# EAGLE schematic d11_micro_usb_std_v2 (EAGLE 7.3.0)
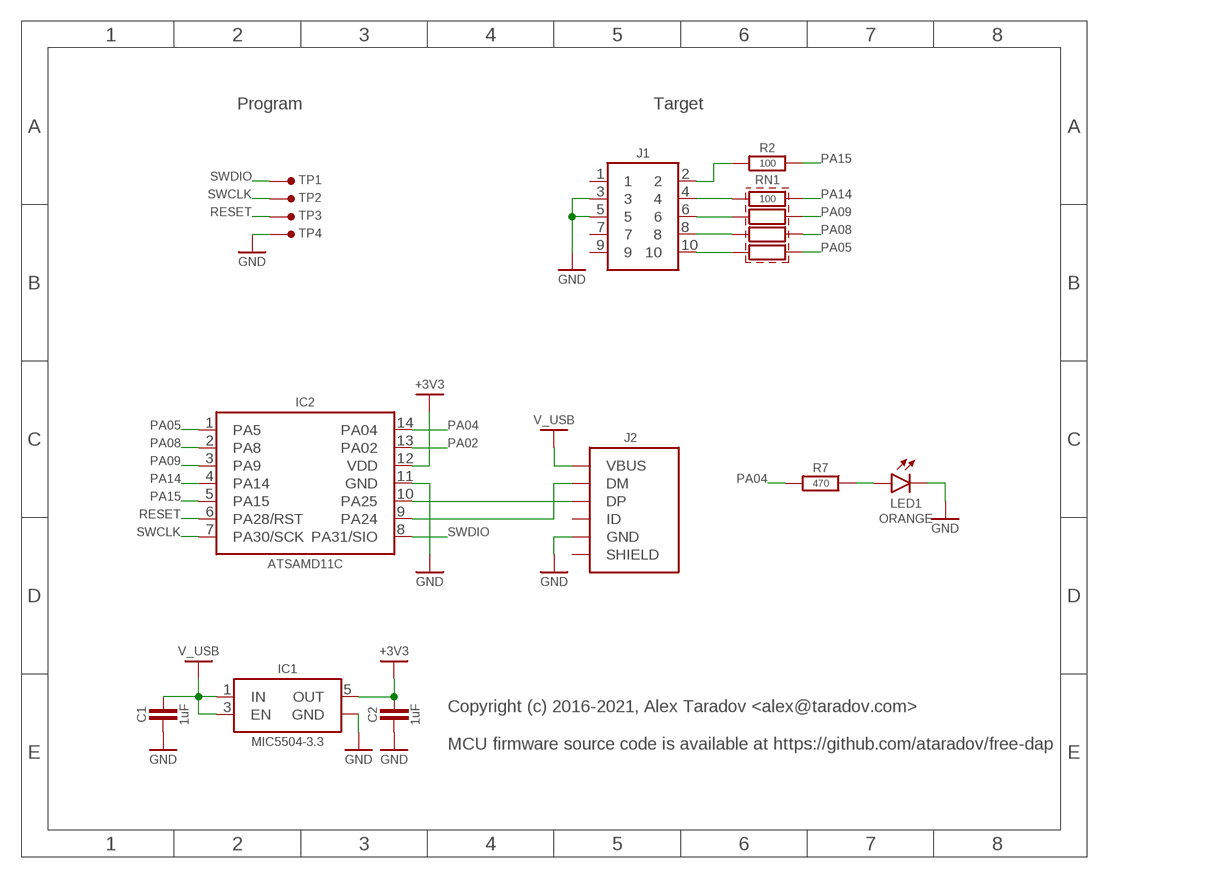
[diagram p0: schematic, sheet 1]

## Parts
C1  1uF  C-0603  [SMD0603]
C2  1uF  C-0603  [SMD0603]
IC1  MIC5504-3.3  MIC5504-SOT23-5  [SOT23-5]
IC2  ATSAMD11C  [SO-14]
J1  HEADER-5X2-TH-1.27  [HEADER-5X2-1.27MM]
J2  USB-B-MICRO-SMT  [USB-B-MICRO-SMT-SHELL-TH]
LED1  ORANGE  LED_SMDLED_0603  [SMD0603]
R2  100  R-0603  [SMD0603]
R7  470  R-0603  [SMD0603]
RN1  100  RN-4-0603-X4  [SMD0603-X4]
TP1  SIO  TEST-POINT-1.27MM  [TP-1.27MM]
TP2  TEST-POINT-1.27MM  [TP-1.27MM]
TP3  TEST-POINT-1.27MM  [TP-1.27MM]
TP4  TEST-POINT-1.27MM  [TP-1.27MM]

## Nets
+3V3: C2.2 IC1.5(OUT) IC2.12(VDD)
GND: C1.1 C2.1 IC1.2(GND) IC2.11(GND) J1.3 J1.5 J2.5(GND) LED1.2(C) TP4.1
N$1: IC2.9(PA24) J2.2(DM)
N$2: IC2.10(PA25) J2.3(DP)
N$3: LED1.1(A) R7.2
N$5: J1.2 R2.1
N$9: J1.4 RN1.1
N$10: J1.6 RN1.2
N$11: J1.8 RN1.3
N$12: J1.10 RN1.4
PA02: IC2.13(PA02)
PA04: IC2.14(PA04) R7.1
PA05: IC2.1(PA5) RN1.5
PA08: IC2.2(PA8) RN1.6
PA09: IC2.3(PA9) RN1.7
PA14: IC2.4(PA14) RN1.8
PA15: IC2.5(PA15) R2.2
RESET: IC2.6(PA28/RST) TP3.1
SWCLK: IC2.7(PA30/SCK) TP2.1
SWDIO: IC2.8(PA31/SIO) TP1.1
V_USB: C1.2 IC1.1(IN) IC1.3(EN) J2.1(VBUS)
Unconnected: J1.1 J1.7 J1.9 J2.4(ID) J2.M1(SHIELD) J2.M2(SHIELD) J2.M3(SHIELD) J2.M4(SHIELD)

## Notes on the sheet
- Program | Target
- Copyright (c) 2016-2021, Alex Taradov <alex@taradov.com>
  
  MCU firmware source code is available at https://github.com/ataradov/free-dap

## Library data of the parts
C1 C2 = ataradov_rlc:C
IC1 = ataradov_vreg:MIC5504: LM1117 voltage regulator
IC2 = ataradov_mcu:ATSAMD11C
J1 = ataradov_conn:HEADER-5X2
J2 = ataradov_conn:USB-B-MICRO
LED1 = ataradov_led:LED_SMD: SMD_LED
R2 R7 = ataradov_rlc:R
RN1 = ataradov_rlc:RN-4
TP1-TP4 = ataradov_misc:TEST-POINT: Test Point